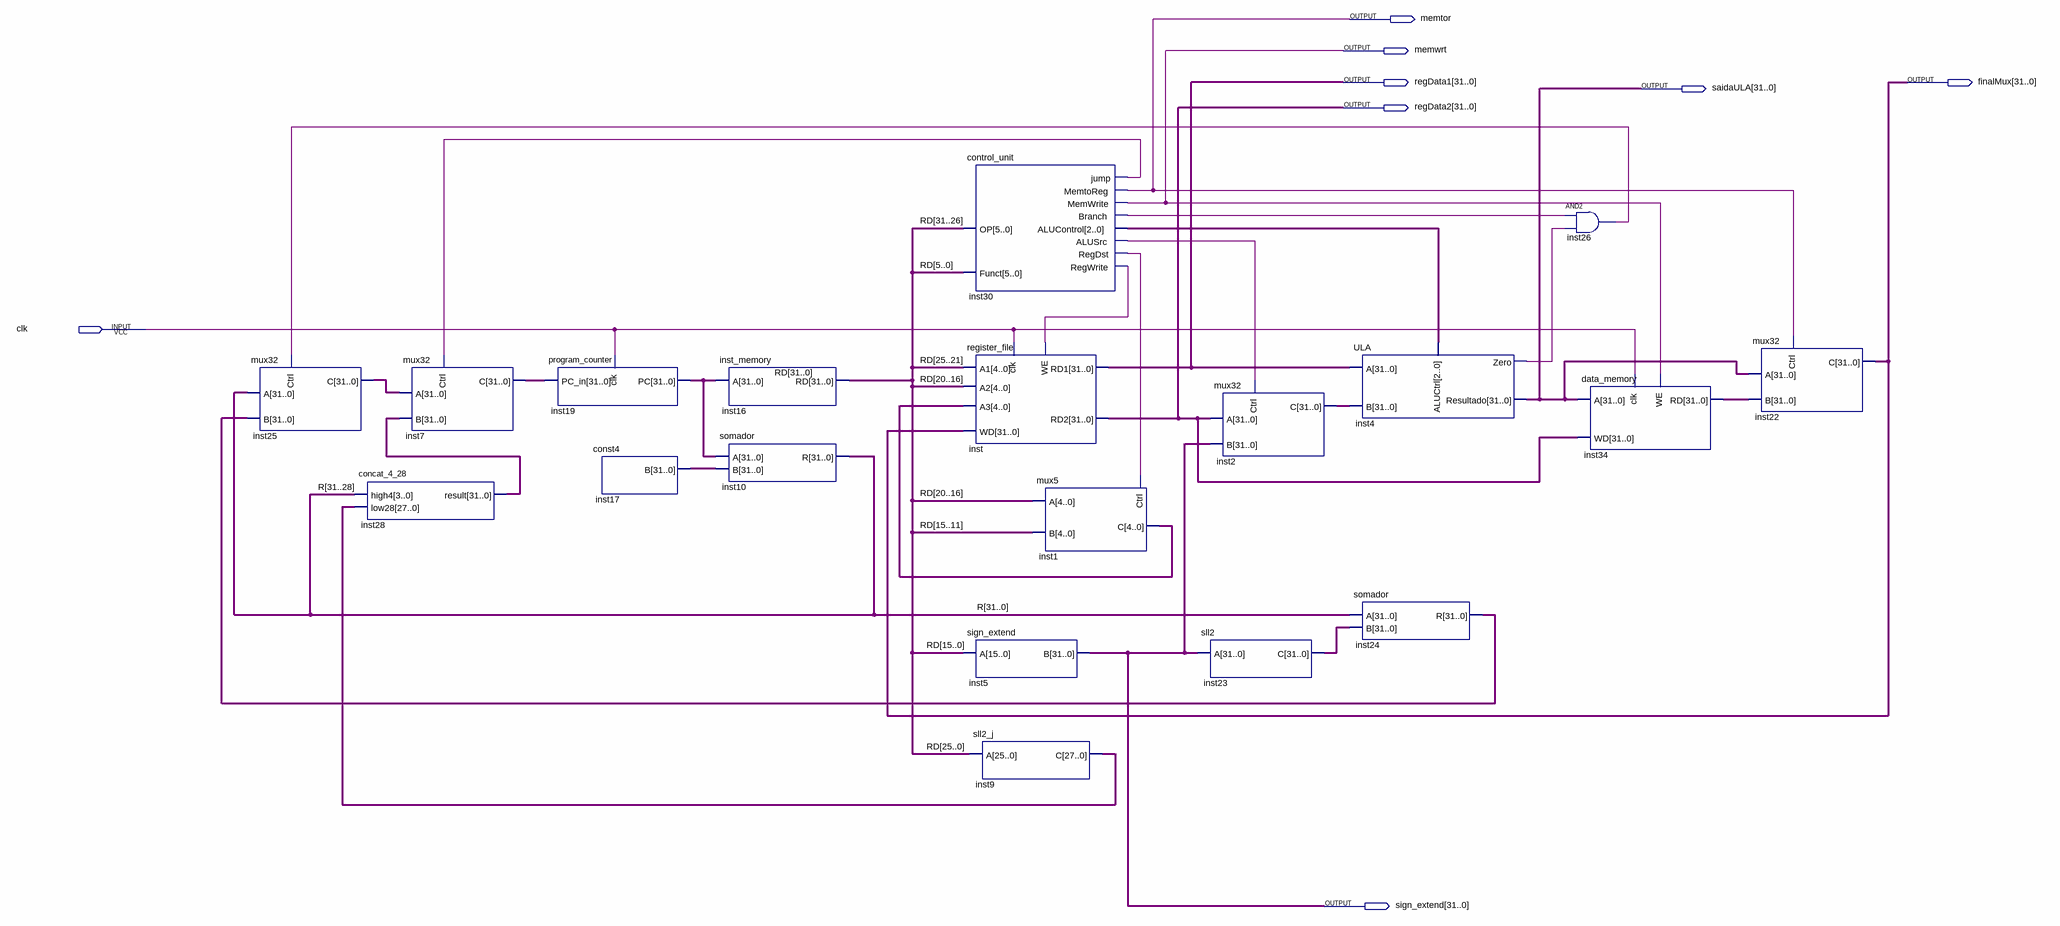
[diagram p0: schematic sheet]
// Quartus schematic MIPSGMN.bdf as structural Verilog: 19 symbols, 8 pins
module MIPSGMN (
  input  clk,
  output memtor,
  output memwrt,
  output [31:0] regData1,
  output [31:0] finalMux,
  output [31:0] saidaULA,
  output [31:0] regData2,
  output [31:0] sign_extend
);

  wire inst4_zero, inst26_out, inst30_alusrc, inst30_branch, inst30_jump, inst30_regdst, inst30_regwrite;
  wire [2:0] inst30_alucontrol;
  wire [4:0] inst1_c;
  wire [27:0] inst9_c;
  wire [31:0] inst2_c, inst7_c, inst17_b, inst19_pc, inst23_c, inst24_r, inst25_c, inst28_result, inst34_rd,
       R, RD;

  mux32 inst25 (.A(R), .B(inst24_r), .Ctrl(inst26_out), .C(inst25_c));
  concat_4_28 inst28 (.high4(R[31:28]), .low28(inst9_c), .result(inst28_result));
  mux32 inst7 (.A(inst25_c), .B(inst28_result), .Ctrl(inst30_jump), .C(inst7_c));
  program_counter inst19 (.clk(clk), .PC_in(inst7_c), .PC(inst19_pc));
  const4 inst17 (.B(inst17_b));
  inst_memory inst16 (.A(inst19_pc), .RD(RD));
  somador inst10 (.A(inst19_pc), .B(inst17_b), .R(R));
  control_unit inst30 (
    .OP(RD[31:26]), .Funct(RD[5:0]), .jump(inst30_jump), .MemtoReg(memtor), .MemWrite(memwrt),
    .Branch(inst30_branch), .ALUSrc(inst30_alusrc), .RegDst(inst30_regdst), .RegWrite(inst30_regwrite),
    .ALUControl(inst30_alucontrol));
  register_file inst (
    .clk(clk), .WE(inst30_regwrite), .A1(RD[25:21]), .A2(RD[20:16]), .A3(inst1_c), .WD(finalMux),
    .RD1(regData1), .RD2(regData2));
  sign_extend inst5 (.A(RD[15:0]), .B(sign_extend));
  sll2_j inst9 (.A(RD[25:0]), .C(inst9_c));
  mux5 inst1 (.A(RD[20:16]), .B(RD[15:11]), .Ctrl(inst30_regdst), .C(inst1_c));
  sll2 inst23 (.A(sign_extend), .C(inst23_c));
  mux32 inst2 (.A(regData2), .B(sign_extend), .Ctrl(inst30_alusrc), .C(inst2_c));
  ULA inst4 (.A(regData1), .B(inst2_c), .ALUCtrl(inst30_alucontrol), .Resultado(saidaULA), .Zero(inst4_zero));
  somador inst24 (.A(R), .B(inst23_c), .R(inst24_r));
  and inst26 (inst26_out, inst30_branch, inst4_zero);
  data_memory inst34 (.clk(clk), .A(saidaULA), .WE(memwrt), .WD(regData2), .RD(inst34_rd));
  mux32 inst22 (.A(saidaULA), .B(inst34_rd), .Ctrl(memtor), .C(finalMux));
endmodule
